# Altium schematic sheet channel_1.SchDoc
size A3; SheetNumber: 9; SheetTotal: 12
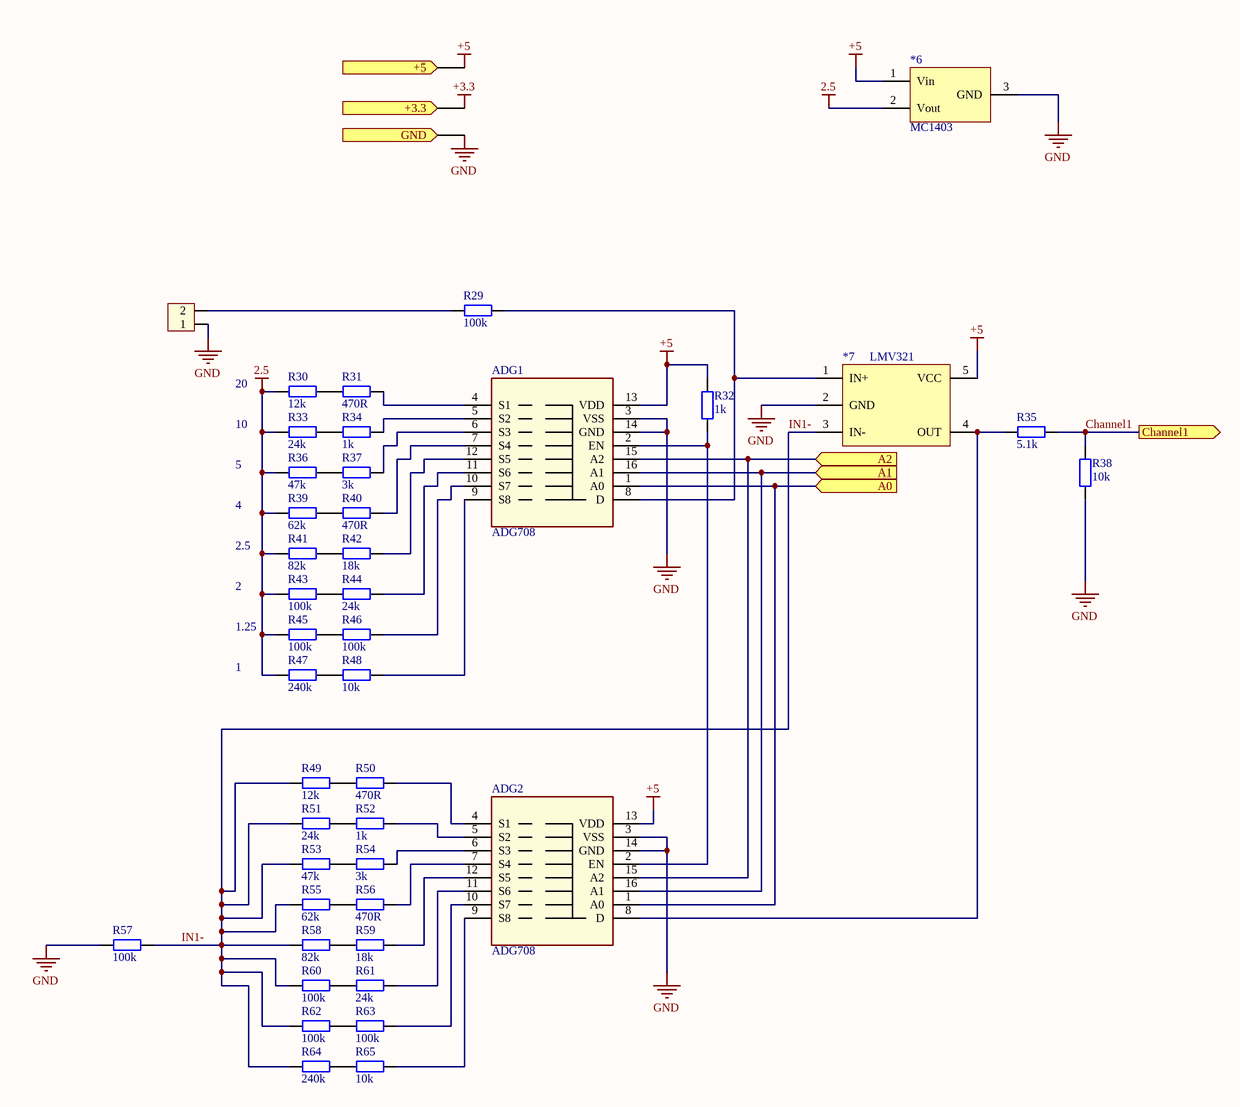
[diagram p0: channel_1.SchDoc]

## Parts
*6  MC1403  [dip8]
*7  LMV321  [SOT23-5]
ADG1  ADG708  [TSSOP16]
ADG2  ADG708  [TSSOP16]
H1  Header 2P 2.54 Duc Thang  [15EDGR-3.81-2P]  (value not drawn)
R29  100k  [tro smd 0603]
R30  12k  [tro smd 0603]
R31  470R  [tro smd 0603]
R32  1k  [tro smd 0603]
R33  24k  [tro smd 0603]
R34  1k  [tro smd 0603]
R35  5.1k  [tro smd 0603]
R36  47k  [tro smd 0603]
R37  3k  [tro smd 0603]
R38  10k  [tro smd 0603]
R39  62k  [tro smd 0603]
R40  470R  [tro smd 0603]
R41  82k  [tro smd 0603]
R42  18k  [tro smd 0603]
R43  100k  [tro smd 0603]
R44  24k  [tro smd 0603]
R45  100k  [tro smd 0603]
R46  100k  [tro smd 0603]
R47  240k  [tro smd 0603]
R48  10k  [tro smd 0603]
R49  12k  [tro smd 0603]
R50  470R  [tro smd 0603]
R51  24k  [tro smd 0603]
R52  1k  [tro smd 0603]
R53  47k  [tro smd 0603]
R54  3k  [tro smd 0603]
R55  62k  [tro smd 0603]
R56  470R  [tro smd 0603]
R57  100k  [tro smd 0603]
R58  82k  [tro smd 0603]
R59  18k  [tro smd 0603]
R60  100k  [tro smd 0603]
R61  24k  [tro smd 0603]
R62  100k  [tro smd 0603]
R63  100k  [tro smd 0603]
R64  240k  [tro smd 0603]
R65  10k  [tro smd 0603]

## Ports
+3.3 (in), +5 (in), A0 (in), A1 (in), A2 (in), Channel1 (out), GND (in)

## Nets
2.5: *6.2(Vout) R30.1 R33.1 R36.1 R39.1 R41.1 R43.2 R45.2 R47.2
+3.3: port +3.3
+5: *6.1(Vin) *7.5(VCC) ADG1.13(VDD) ADG2.13(VDD) R32.2 ; port +5
GND: *6.3(GND) *7.2(GND) ADG1.3(VSS) ADG1.14(GND) ADG2.3(VSS) ADG2.14(GND) H1.1 R38.1 R57.2 ; port GND
A0: ADG1.1(A0) ADG2.1(A0) ; port A0
A1: ADG1.16(A1) ADG2.16(A1) ; port A1
A2: ADG1.15(A2) ADG2.15(A2) ; port A2
Channel1: R35.2 R38.2 ; port Channel1
IN1-: *7.3(IN-) R49.1 R51.1 R53.1 R55.1 R57.1 R58.1 R60.2 R62.2 R64.2
Net*7_1: *7.1(IN+) ADG1.8(D) R29.2
Net*7_4: *7.4(OUT) ADG2.8(D) R35.1
NetADG1_2: ADG1.2(EN) ADG2.2(EN) R32.1
NetADG1_4: ADG1.4(S1) R31.2
NetADG1_5: ADG1.5(S2) R34.2
NetADG1_6: ADG1.6(S3) R37.2
NetADG1_7: ADG1.7(S4) R40.2
NetADG1_9: ADG1.9(S8) R48.1
NetADG1_10: ADG1.10(S7) R46.1
NetADG1_11: ADG1.11(S6) R44.2
NetADG1_12: ADG1.12(S5) R42.2
NetADG2_4: ADG2.4(S1) R50.2
NetADG2_5: ADG2.5(S2) R52.2
NetADG2_6: ADG2.6(S3) R54.2
NetADG2_7: ADG2.7(S4) R56.2
NetADG2_9: ADG2.9(S8) R65.1
NetADG2_10: ADG2.10(S7) R63.1
NetADG2_11: ADG2.11(S6) R61.2
NetADG2_12: ADG2.12(S5) R59.2
NetH1_2: H1.2 R29.1
NetR30_2: R30.2 R31.1
NetR33_2: R33.2 R34.1
NetR36_2: R36.2 R37.1
NetR39_2: R39.2 R40.1
NetR41_2: R41.2 R42.1
NetR43_1: R43.1 R44.1
NetR45_1: R45.1 R46.2
NetR47_1: R47.1 R48.2
NetR49_2: R49.2 R50.1
NetR51_2: R51.2 R52.1
NetR53_2: R53.2 R54.1
NetR55_2: R55.2 R56.1
NetR58_2: R58.2 R59.1
NetR60_1: R60.1 R61.1
NetR62_1: R62.1 R63.2
NetR64_1: R64.1 R65.2

## Notes on the sheet
- 20
- 10
- 5
- 4
- 2.5
- 2
- 1.25
- 1

## Library data of the parts
H1 = Header 2P 2.54 Duc Thang: Cắm; Ten_Linh_Kien: Header 2P XH2.54-2P Đực Thẳng; Don_Vi: Con; Ma_Hang: MH001283; Chung_Loai: Cắm
R29 R43 R45-R48 R57 R60 R62-R65 = Tro 2512 5% 100k: Dán; Don_Vi: Con; So_Chan: 2; Ten_Linh_Kien: Trở 2512 5% 104-100k 1W; Ma_Hang: MH001941; Chung_Loai: Dán; Kieu_Chan: *
R30-R42 R44 R49-R56 R58 R59 R61 = Tro 0603 1% 10k: Dán; Don_Vi: Con; So_Chan: 2; Ten_Linh_Kien: Trở 0603 1% 10k; Ma_Hang: MH006333; Chung_Loai: Dán; Kieu_Chan: *